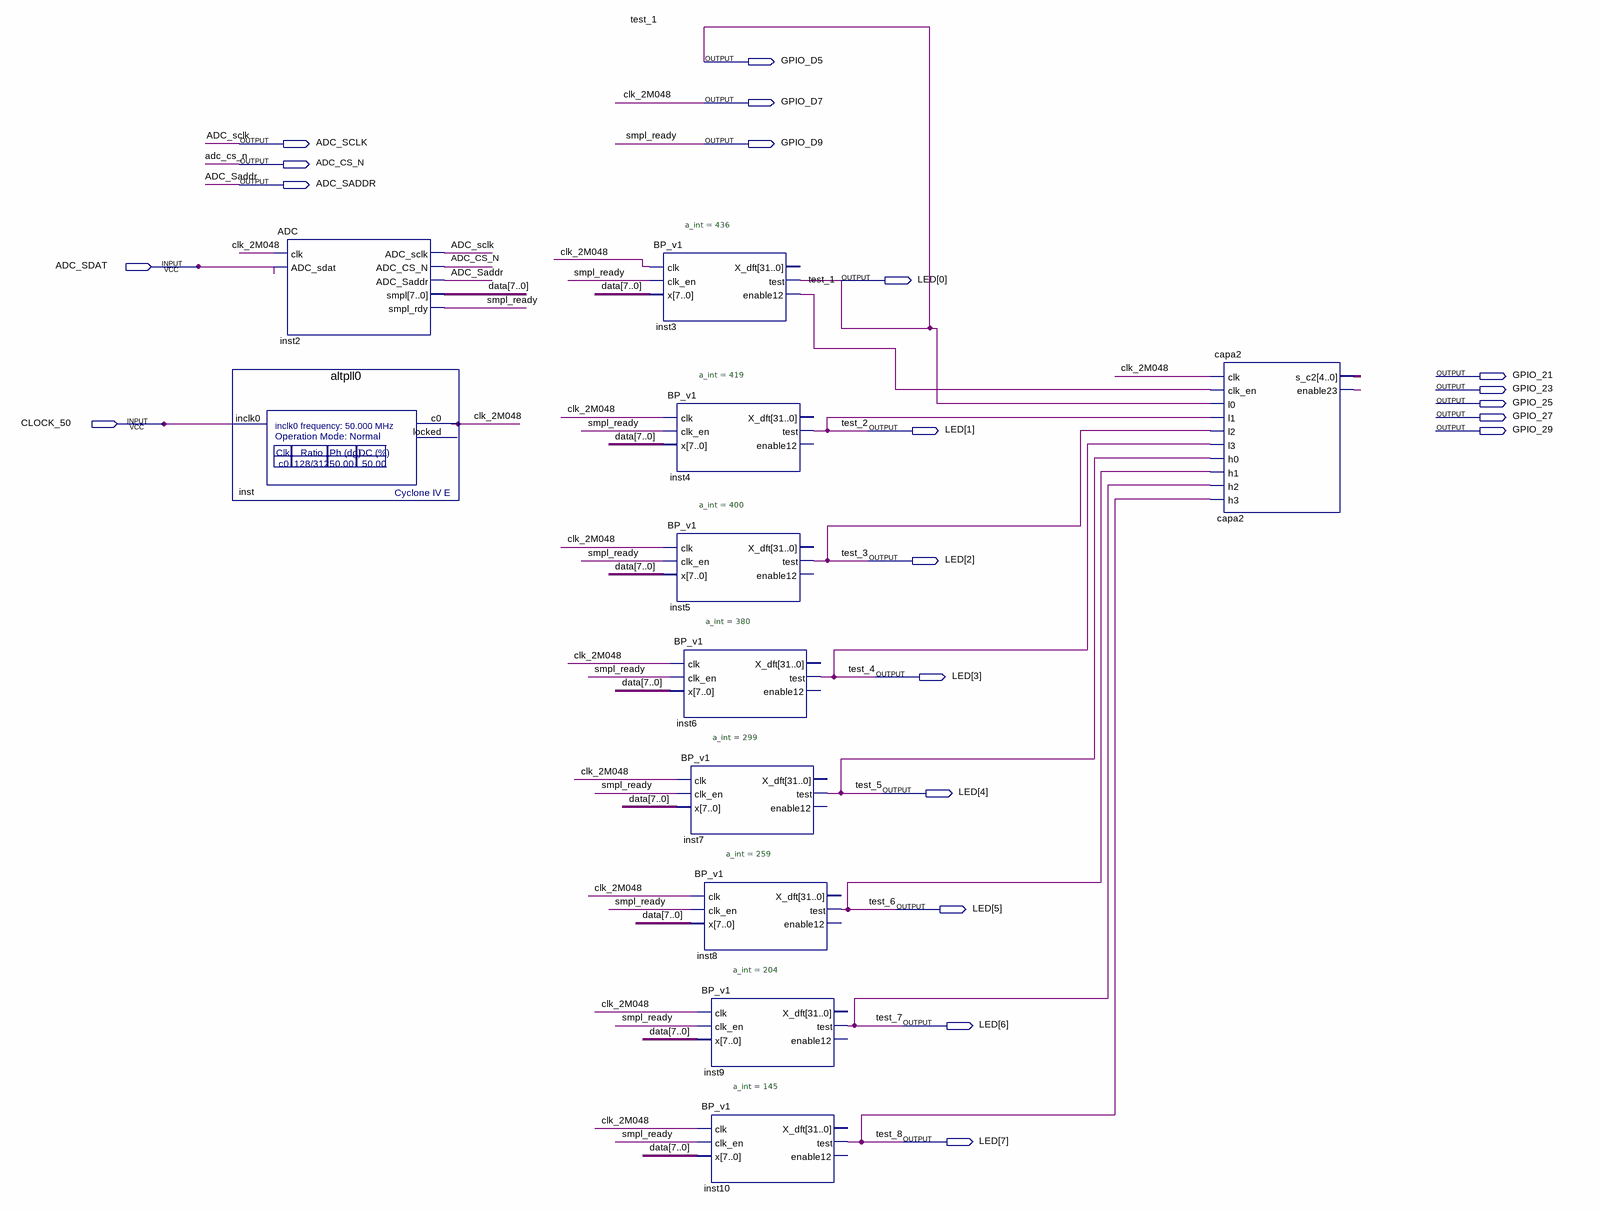
[diagram p0: schematic sheet]
// Quartus schematic main_c2.bdf as structural Verilog: 11 symbols, 21 pins
module main_c2 (
  input  ADC_SDAT,
  input  CLOCK_50,
  output GPIO_D5,
  output GPIO_D7,
  output ADC_SCLK,
  output GPIO_D9,
  output ADC_CS_N,
  output ADC_SADDR,
  output [7:0] LED,
  output GPIO_21,
  output GPIO_23,
  output GPIO_25,
  output GPIO_27,
  output GPIO_29
);

  wire capa2_enable23, inst3_enable12;
  wire [4:0] capa2_s_c2;
  wire [7:0] data;

  ADC inst2 (
    .clk(GPIO_D7), .ADC_sdat(ADC_SDAT), .ADC_sclk(ADC_SCLK), .ADC_CS_N(ADC_CS_N), .ADC_Saddr(ADC_SADDR),
    .smpl(data), .smpl_rdy(GPIO_D9));
  altpll0 inst (.inclk0(CLOCK_50), .c0(GPIO_D7));  // open: locked
  BP_v1 #(.a_int(436)) inst3 (
    .clk(GPIO_D7), .clk_en(GPIO_D9), .x(data), .test(GPIO_D5), .enable12(inst3_enable12));  // open: X_dft
  BP_v1 #(.a_int(419)) inst4 (.clk(GPIO_D7), .clk_en(GPIO_D9), .x(data), .test(LED[1]));  // open: X_dft, enable12
  BP_v1 #(.a_int(400)) inst5 (.clk(GPIO_D7), .clk_en(GPIO_D9), .x(data), .test(LED[2]));  // open: X_dft, enable12
  BP_v1 #(.a_int(380)) inst6 (.clk(GPIO_D7), .clk_en(GPIO_D9), .x(data), .test(LED[3]));  // open: X_dft, enable12
  BP_v1 #(.a_int(299)) inst7 (.clk(GPIO_D7), .clk_en(GPIO_D9), .x(data), .test(LED[4]));  // open: X_dft, enable12
  BP_v1 #(.a_int(259)) inst8 (.clk(GPIO_D7), .clk_en(GPIO_D9), .x(data), .test(LED[5]));  // open: X_dft, enable12
  BP_v1 #(.a_int(204)) inst9 (.clk(GPIO_D7), .clk_en(GPIO_D9), .x(data), .test(LED[6]));  // open: X_dft, enable12
  BP_v1 #(.a_int(145)) inst10 (.clk(GPIO_D7), .clk_en(GPIO_D9), .x(data), .test(LED[7]));  // open: X_dft, enable12
  capa2 capa2 (
    .clk(GPIO_D7), .clk_en(inst3_enable12), .l0(GPIO_D5), .l1(LED[1]), .l2(LED[2]), .l3(LED[3]), .h0(LED[4]),
    .h1(LED[5]), .h2(LED[6]), .h3(LED[7]), .s_c2(capa2_s_c2), .enable23(capa2_enable23));

  assign LED[0] = GPIO_D5;

  // Other names for the same wires on the sheet: clk_2M048 = GPIO_D7; test_1 = GPIO_D5; smpl_ready = GPIO_D9;
  //   test_2 = LED[1]; test_3 = LED[2]; test_4 = LED[3]; test_5 = LED[4]; test_6 = LED[5]; test_7 = LED[6];
  //   test_8 = LED[7]
endmodule
